# EAGLE schematic 4BSS rev.A (EAGLE 7.1.0)
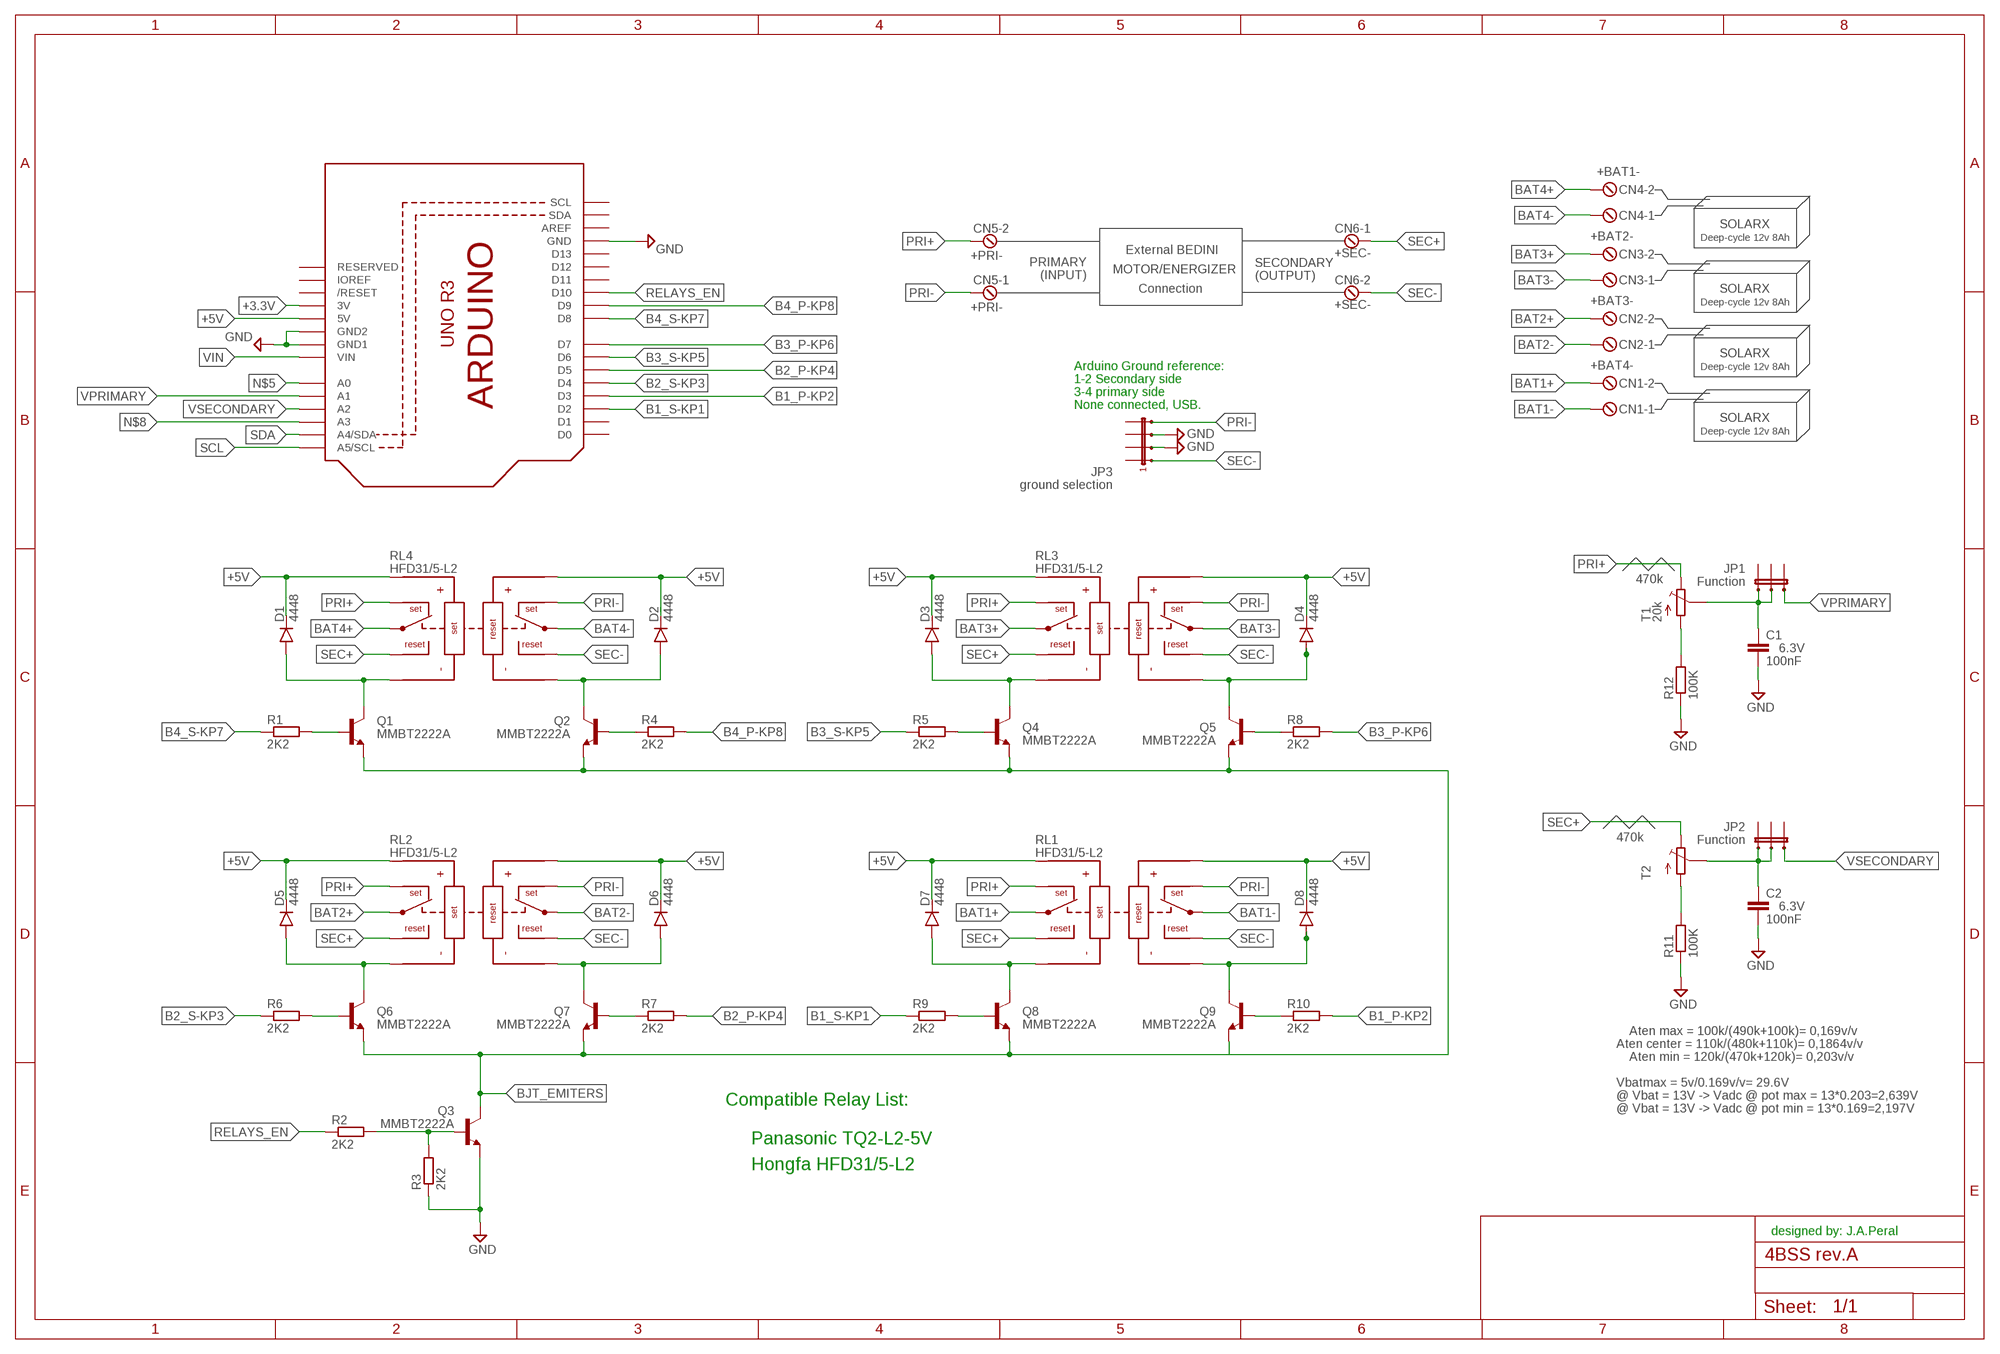
[diagram p0: schematic, sheet 1]

## Parts
C1  CL10B105KQ8NNNC  [0603]
C2  CL10B105KQ8NNNC  [0603]
CN1  1776275-2  [TERMINALBLOCK_3.5MMPITCH_2WAY]
CN2  1776275-2  [TERMINALBLOCK_3.5MMPITCH_2WAY]
CN3  1776275-2  [TERMINALBLOCK_3.5MMPITCH_2WAY]
CN4  1776275-2  [TERMINALBLOCK_3.5MMPITCH_2WAY]
CN5  1776275-2  [TERMINALBLOCK_3.5MMPITCH_2WAY]
CN6  1776275-2  [TERMINALBLOCK_3.5MMPITCH_2WAY]
D1  LS4448  [SOD-80C]
D2  LS4448  [SOD-80C]
D3  LS4448  [SOD-80C]
D4  LS4448  [SOD-80C]
D5  LS4448  [SOD-80C]
D6  LS4448  [SOD-80C]
D7  LS4448  [SOD-80C]
D8  LS4448  [SOD-80C]
JP1  TSW-103-07-T-S  [3WAY-2.54MM]
JP2  TSW-103-07-T-S  [3WAY-2.54MM]
JP3  TSW-104-07-T-S  [4WAY-2.54MM]
Q1  MMBT2222A  [SOT23]
Q2  MMBT2222A  [SOT23]
Q3  MMBT2222A  [SOT23]
Q4  MMBT2222A  [SOT23]
Q5  MMBT2222A  [SOT23]
Q6  MMBT2222A  [SOT23]
Q7  MMBT2222A  [SOT23]
Q8  MMBT2222A  [SOT23]
Q9  MMBT2222A  [SOT23]
R1  RC0805JR-072K2L  [0805]
R2  RC0805JR-072K2L  [0805]
R3  RC0805JR-072K2L  [0805]
R4  RC0805JR-072K2L  [0805]
R5  RC0805JR-072K2L  [0805]
R6  RC0805JR-072K2L  [0805]
R7  RC0805JR-072K2L  [0805]
R8  RC0805JR-072K2L  [0805]
R9  RC0805JR-072K2L  [0805]
R10  RC0805JR-072K2L  [0805]
R11  RC0805JR-07100KL  [0805]
R12  RC0805JR-07100KL  [0805]
RL1  HFD31/5-L2  [HFD31]
RL2  HFD31/5-L2  [HFD31]
RL3  HFD31/5-L2  [HFD31]
RL4  HFD31/5-L2  [HFD31]
T1  3296W-1-204LF  [W]
T2  3296W-1-503LF  [W]
U1  ARDUINOR3-NOHOLES  [ARDUINO-NOHOLESR3]

## Nets
+3.3V: U1.3V
+5V: D1.C D2.C D3.C D4.C D5.C D6.C D7.C D8.C RL1.1 RL1.10 RL2.1 RL2.10 RL3.1 RL3.10 RL4.1 RL4.10 U1.5V
B1_P-KP2: R10.2 U1.D3
B1_S-KP1: R9.1 U1.D2
B2_P-KP4: R7.2 U1.D5
B2_S-KP3: R6.1 U1.D4
B3_P-KP6: R8.2 U1.D7
B3_S-KP5: R5.1 U1.D6
B4_P-KP8: R4.2 U1.D9
B4_S-KP7: R1.1 U1.D8
BAT1+: CN1.2 RL1.3
BAT1-: CN1.1 RL1.8
BAT2+: CN2.2 RL2.3
BAT2-: CN2.1 RL2.8
BAT3+: CN3.2 RL3.3
BAT3-: CN3.1 RL3.8
BAT4+: CN4.2 RL4.3
BAT4-: CN4.1 RL4.8
BJT_EMITERS: Q1.2(E) Q2.2(E) Q3.3(C) Q4.2(E) Q5.2(E) Q6.2(E) Q7.2(E) Q8.2(E) Q9.2(E)
GND: C1.2 C2.2 JP3.2 JP3.3 Q3.2(E) R3.1 R11.1 R12.1 U1.GND U1.GND1 U1.GND2
N$1: Q1.1(B) R1.2
N$2: D3.A Q4.3(C) RL3.5
N$3: D4.A Q5.3(C) RL3.6
N$4: Q2.1(B) R4.1
N$5: U1.A0
N$6: C2.1 JP2.1 JP2.2 T2.S
N$7: C1.1 JP1.1 JP1.2 T1.S
N$8: U1.A3
N$9: D1.A Q1.3(C) RL4.5
N$10: D2.A Q2.3(C) RL4.6
N$11: R12.2 T1.A
N$12: D5.A Q6.3(C) RL2.5
N$13: Q4.1(B) R5.2
N$15: Q5.1(B) R8.1
N$16: Q3.1(B) R2.2 R3.2
N$17: D6.A Q7.3(C) RL2.6
N$18: Q6.1(B) R6.2
N$19: Q7.1(B) R7.1
N$20: D7.A Q8.3(C) RL1.5
N$21: D8.A Q9.3(C) RL1.6
N$22: Q8.1(B) R9.2
N$23: Q9.1(B) R10.1
N$24: R11.2 T2.A
PRI+: CN5.2 RL1.2 RL2.2 RL3.2 RL4.2 T1.E
PRI-: CN5.1 JP3.4 RL1.9 RL2.9 RL3.9 RL4.9
RELAYS_EN: R2.1 U1.D10
SCL: U1.A5(A5/SCL)
SDA: U1.A4(A4/SDA)
SEC+: CN6.1 RL1.4 RL2.4 RL3.4 RL4.4 T2.E
SEC-: CN6.2 JP3.1 RL1.7 RL2.7 RL3.7 RL4.7
VIN: U1.VIN
VPRIMARY: JP1.3 U1.A1
VSECONDARY: JP2.3 U1.A2
Unconnected: U1.AREF U1.D0 U1.D1 U1.D11 U1.D12 U1.D13 U1.IOREF U1.NC(RESERVED) U1.RESET(/RESET) U1.SCL U1.SDA

## Notes on the sheet
- SOLARX
- Deep-cycle 12v 8Ah
- PRIMARY | External BEDINI
- (INPUT) | SECONDARY
- MOTOR/ENERGIZER
- (OUTPUT)
- Connection | SOLARX
- Deep-cycle 12v 8Ah
- SOLARX
- Arduino Ground reference: | Deep-cycle 12v 8Ah
- 1-2 Secondary side
- 3-4 primary side
- None connected, USB.
- SOLARX
- Deep-cycle 12v 8Ah
- 470k
- 470k
- Aten max = 100k/(490k+100k)= 0,169v/v
- Aten center = 110k/(480k+110k)= 0,1864v/v
- Aten min = 120k/(470k+120k)= 0,203v/v
- Vbatmax = 5v/0.169v/v= 29.6V
- @ Vbat = 13V -> Vadc @ pot max = 13*0.203=2,639V
- Compatible Relay List:
- @ Vbat = 13V -> Vadc @ pot min = 13*0.169=2,197V
- Panasonic TQ2-L2-5V
- Hongfa HFD31/5-L2
- designed by: J.A.Peral

## Library data of the parts
C1 C2 = Capacitors:CL10B105KQ8NNNC: CAPACITOR, 1uF, 6.3V, 0603, Ceramic multilayer, X7R, 10%; MANUFACTURER: Samsung; MOUNT: Yes; PACKAGE: 6.3V; REPLACEABLE: Yes; TYPE: X7R; VAL: 100nF; VOLTAGE: 6.3V; _DIGIKEY_CODE: 1276-1024-2-ND
CN1 = Connectors:1776275-2: CONNECTOR, Terminal Block, 2 pos, Side entry, Screw, 3.5mm pitch; VAL: +BAT4-
CN2 = Connectors:1776275-2: CONNECTOR, Terminal Block, 2 pos, Side entry, Screw, 3.5mm pitch; VAL: +BAT3-
CN3 = Connectors:1776275-2: CONNECTOR, Terminal Block, 2 pos, Side entry, Screw, 3.5mm pitch; VAL: +BAT2-
CN4 = Connectors:1776275-2: CONNECTOR, Terminal Block, 2 pos, Side entry, Screw, 3.5mm pitch; VAL: +BAT1-
CN5 = Connectors:1776275-2: CONNECTOR, Terminal Block, 2 pos, Side entry, Screw, 3.5mm pitch; VAL: +PRI-
CN6 = Connectors:1776275-2: CONNECTOR, Terminal Block, 2 pos, Side entry, Screw, 3.5mm pitch; VAL: +SEC-
D1-D8 = Diodes:?4448: DIODE, Small signal, fast switching, IFSM=2A, IFRM=500mA, IF=300mA, SOD-80C Repetitive peak reverse voltage VRRM 100 V Reverse voltage VR 75 V Peak forward surge current tp = 1 ?s IFSM 2 A Repetitive peak forward current IFRM 500 mA Forward continuous current IF 300 mA Average forward current VR = 0 IFAV 150 mA Power dissipation Ptot 500 mW Silicon Epitaxial Planar Diodes Electrical data identical with the devices 1N4148 and 1N4448 respectively Quadro Melf package Lead (Pb)-free component Component in accordance to RoHS 2002/95/EC and WEEE 2002/96/EC Manufacturer Vishay: LS4448GS08 Distributor: Farnell: 1617732, 0,04 eur @ 5-24 uds 0,034 eur @ 25-99 uds 0,029 eur @ 100-499 0,02 eur @ 500-999 0,017 eur @ 1000 +; CURRENT: 500mA; MANUFACTURER: Vishay; MOUNT: Yes; PACKAGE: SOD-80C; REPLACEABLE: Yes; TYPE: DIODE, Small signal, fast switching; VAL: 4448; _FARNELL_CODE: 1617732; _FARNELL_PRICE_1: 0,029; _FARNELL_PRICE_1_QTY: 100-499
JP1 JP2 = Connectors:TSW-103-07-T-S: HEADER MALE PIN, 1Row, 3/50 Way, 5.84mm mating lenght, 2.54mm pitch, Straight, Breakway, Tin, Throught hole Category Connectors Family Board to Board - Headers, Male Pin Series TSW Color Black Connector Type Unshrouded Contact Finish Tin Contact Finish Thickness - Contact Mating Length 0.230" (5.84mm) Features - Height Above Board 0.100" (2.54mm) Height Stacking (Mating) - Mounting Type Through Hole Number of Contacts Loaded All Number of Positions 50 Number of Rows 1 Packaging Bulk Pitch 0.100" (2.54mm) Row Spacing - Termination Solder Other Names SAM1035-50 SAM1035-50-ND TSW-150-07-T-S Manufacturer: Samtec Inc: TSW-150-07-T-S Distributor Digikey: SAM1035-50-ND, 1.315 eur @ 10-99 uds.; MANUFACTURER: Samtec Inc.; MOUNT: Yes; PACKAGE: 3x 2.54mm pitch; REPLACEABLE: Yes; TYPE: HEADER MALE PIN, 1Row, 3/50 Way, 5.84mm mating lenght, Straight, Breakway, Tin, Throught hole; VAL: Function; _DIGIKEY_CODE: SAM1035-03-ND
JP3 = Connectors:TSW-104-07-T-S: HEADER MALE PIN, 1Row, 4/50 Way, 5.84mm mating lenght, 2.54mm pitch, Straight, Breakway, Tin, Throught hole Category Connectors Family Board to Board - Headers, Male Pin Series TSW Color Black Connector Type Unshrouded Contact Finish Tin Contact Finish Thickness - Contact Mating Length 0.230" (5.84mm) Features - Height Above Board 0.100" (2.54mm) Height Stacking (Mating) - Mounting Type Through Hole Number of Contacts Loaded All Number of Positions 50 Number of Rows 1 Packaging Bulk Pitch 0.100" (2.54mm) Row Spacing - Termination Solder Other Names SAM1035-50 SAM1035-50-ND TSW-150-07-T-S Manufacturer: Samtec Inc: TSW-150-07-T-S Distributor Digikey: SAM1035-50-ND, 1.315 eur @ 10-99 uds.; MANUFACTURER: Samtec Inc.; MOUNT: Yes; PACKAGE: 4x 2.54mm pitch; REPLACEABLE: Yes; TYPE: HEADER MALE PIN, 1Row, 4/50 Way, 5.84mm mating lenght, Straight, Breakway, Tin, Throught hole; VAL: ground selection
Q1-Q9 = BJT Transistors:?2222A: TRANSISTOR, BJT, NPN, General Purpose, Idmax=600, Vcemax=40V BJT, NPN Silicon Id max = 600mA Vce max = 40v Veb max = 6V; CURRENT: 600mA; MANUFACTURER: On semiconductor; MOUNT: Yes; PACKAGE: SOT-23; REPLACEABLE: No; TYPE: TRANSISTOR, BJT, NPN, General Purpose, Idmax=600, Vcemax=40V; VAL: MMBT2222A; VOLTAGE: 40V; _DIGIKEY_CODE: MMBT2222ALT1GOSCT-ND; _FARNELL_CODE: 1459098; _MOUSER_CODE: 863-MMBT2222ALT1G
R1-R10 = Resistor_5%_Yageo:RC?JR-07*L: RESISTOR, General purpose resistor, 5%, 200v, 100ppm/ºC; MANUFACTURER: Yageo; MOUNT: Yes; PACKAGE: 0805; POWER: 1/8W; REPLACEABLE: Yes; TOLERANCE: 5%; TYPE: RESISTOR, Thick Film, General Purpose, 100ppm; VAL: 2K2; VOLTAGE: 150V
R11 R12 = Resistor_5%_Yageo:RC?JR-07*L: RESISTOR, General purpose resistor, 5%, 200v, 100ppm/ºC; MANUFACTURER: Yageo; MOUNT: Yes; PACKAGE: 0805; POWER: 1/8W; REPLACEABLE: Yes; TOLERANCE: 5%; TYPE: RESISTOR, Thick Film, General Purpose, 100ppm; VAL: 100K; VOLTAGE: 150V
RL1-RL4 = Relays:HFD31/*-L2: Subminiature dual coil latching signal relay * Max DC current 1A * Dual Pole Dual Trought (DPDT) * Dual coil latching (set coil & reset coil). * Low power consumption; MANUFACTURER: Hongfa; VAL: HFD31/5-L2
T1 = Potentiometers_Trimmers:3296: POTENTIOMETER, Trimmer, Square, Multiturn, 25 +-2 Turn, Cermet, Top Adjustment, 3/8'' Manufacturer: BOURNS: 3296W-1-xxxLF (stright line pin alignment) BOURNS: 3296Y -1-xxxLF (zigzag pin alignment) Distributor: "W" 503 - _50K - 0.93 eur @ 1ud 521-9805 (Amidata), 2.18 eur @ 1ud 9353305 (Farnell). 104 - 100K - 0.96 eur @ 1ud 521-9653 (Amidata), 2.18 eur @ 1ud 9353194 (Farnell). 204 - 200K - 0.96 eur @ 1ud 521-9726 (Amidata), 2.18 eur @ 1ud 9353259 (Farnell). 504 - 500K - 0.96 eur @ 1ud 521-9811 (Amidata), 2.18 eur @ 1ud 9353313 (Farnell). 205 - ---2M - 0.95 eur @ 1ud 521-9748 (Amidata), 2.02 eur @ 1ud 9353267 (Farnell).; VAL: 20k
T2 = Potentiometers_Trimmers:3296: POTENTIOMETER, Trimmer, Square, Multiturn, 25 +-2 Turn, Cermet, Top Adjustment, 3/8'' Manufacturer: BOURNS: 3296W-1-xxxLF (stright line pin alignment) BOURNS: 3296Y -1-xxxLF (zigzag pin alignment) Distributor: "W" 503 - _50K - 0.93 eur @ 1ud 521-9805 (Amidata), 2.18 eur @ 1ud 9353305 (Farnell). 104 - 100K - 0.96 eur @ 1ud 521-9653 (Amidata), 2.18 eur @ 1ud 9353194 (Farnell). 204 - 200K - 0.96 eur @ 1ud 521-9726 (Amidata), 2.18 eur @ 1ud 9353259 (Farnell). 504 - 500K - 0.96 eur @ 1ud 521-9811 (Amidata), 2.18 eur @ 1ud 9353313 (Farnell). 205 - ---2M - 0.95 eur @ 1ud 521-9748 (Amidata), 2.02 eur @ 1ud 9353267 (Farnell).; VAL: 20K
U1 = adafruit agosto 2013:ARDUINOR3: This is a new object for the new Arduino R3 - with extra pins that you may want to use (such as IOref, and duplicated A4/A5